# Altium schematic sheet Programmer.SchDoc
size A; SheetNumber: 3; SheetTotal: 5
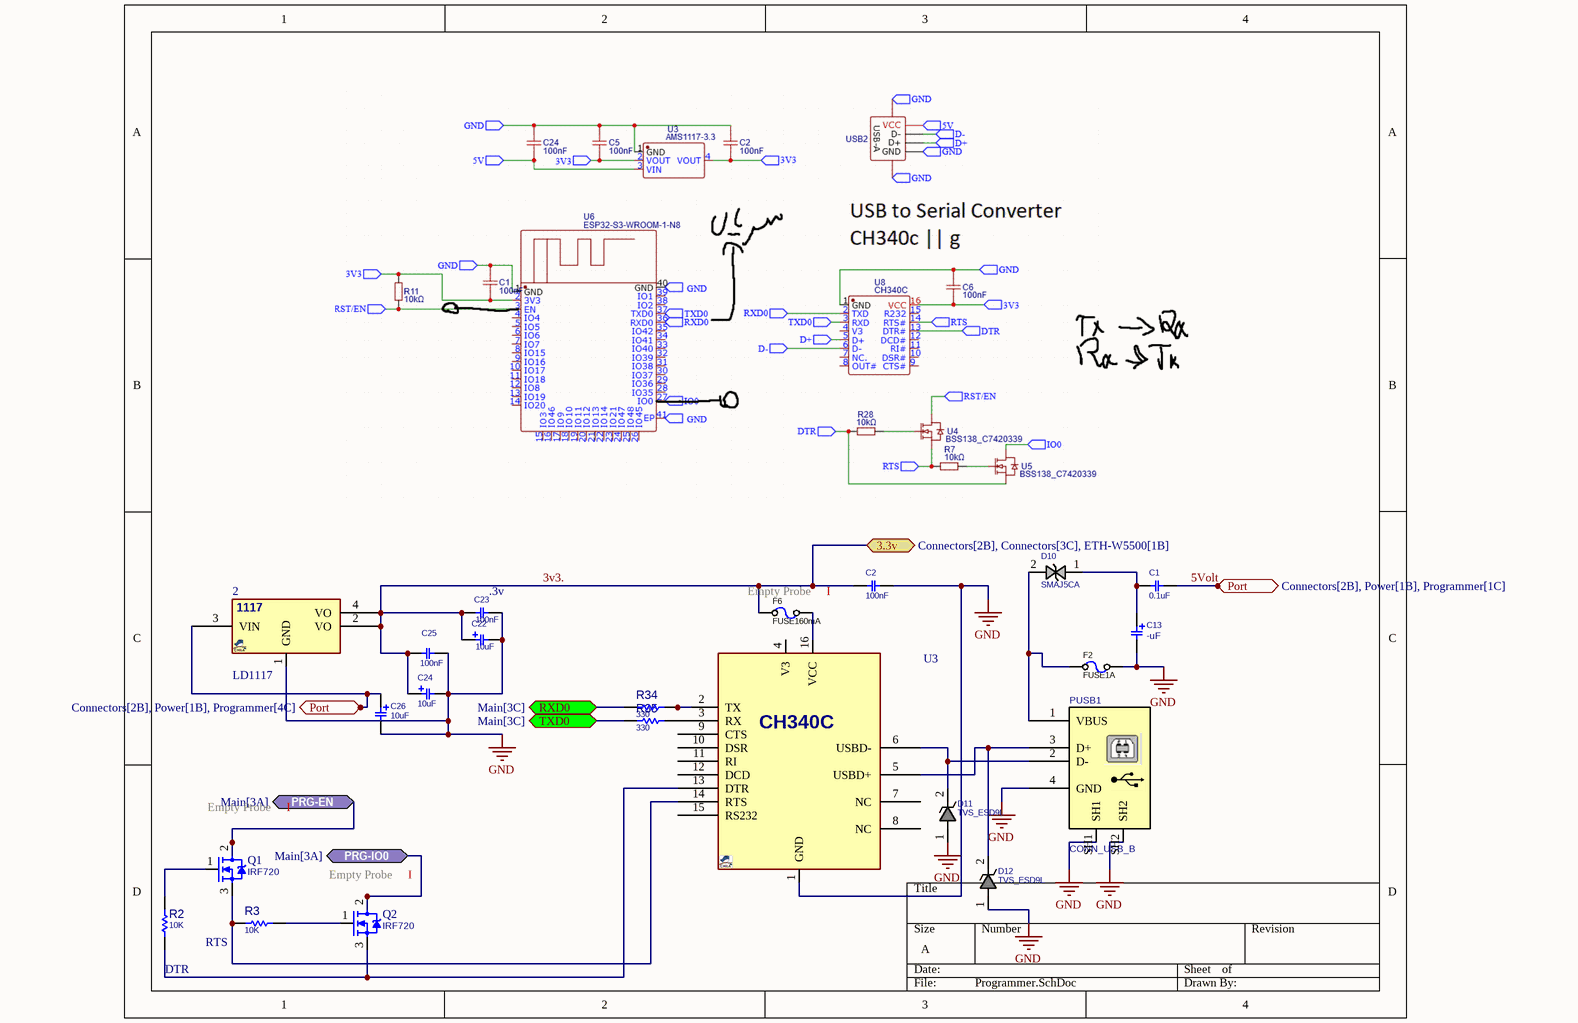
[diagram p0: Programmer.SchDoc]

## Parts
2  LD1117  [SOT223_4]
C1  0.1uF  [C_CERM_D4]
C2  100nF  [C_CERM_D3]
C13  -uF  [C_TN_3216]
C22  10uF  [C_EL_4X7]
C23  100nF  [C_CERM_D3]
C24  10uF  [C_EL_4X7]
C25  100nF  [C_CERM_D3]
C26  10uF  [C_EL_4X7]
D10  SMAJ5CA  [D_SMA]
D11  TVS_ESD9L  [D_SOD923]
D12  TVS_ESD9L  [D_SOD923]
F2  FUSE1A  [F2920]
F6  FUSE160mA  [F1206]
PUSB1  CONN_USB_B  [USB_B_RA_THD]
Q1  IRF720  [TO220_3]
Q2  IRF720  [TO220_3]
R2  10K  [R025W_AX04]
R3  10K  [R025W_AX04]
R34  330  [R025W_AX04]
R35  330  [R025W_AX04]
U3  CH340C  [SO_16]  (value not drawn)

## Ports
3.3v (bidir, see Connectors[2B], Connectors[3C], ETH-W5500[1B]), Port (bidir, see Connectors[2B], Power[1B], Programmer[1C]), Port (bidir, see Connectors[2B], Power[1B], Programmer[4C]), PRG-EN (bidir, see Main[3A]), PRG-IO0 (bidir, see Main[3A]), RXD0 (bidir, see Main[3C]), TXD0 (bidir, see Main[3C])

## Nets
GND: 2.1(GND) C2.1 C13.2 C22.2 C23.2 C24.2 C25.2 C26.2 D11.1 D12.1 F2.1 PUSB1.4(GND) PUSB1.SH1 PUSB1.SH2 U3.1(GND)
3v3.: 2.2(VO) 2.4(VO) C2.2 C22.1 C23.1 C24.1 C25.1 F6.1 ; port 3.3v
5Volt: 2.3(VIN) C1.2 C26.1 ; port Port
PRG-EN: Q1.2(D) ; port PRG-EN
PRG-IO0: Q2.2(D) ; port PRG-IO0
RXD0: R34.1 ; port RXD0
TXD0: R35.1 ; port TXD0
NetC1_1: C1.1 C13.1 D10.1
NetD10_2: D10.2 F2.2 PUSB1.1(VBUS)
NetD11_2: D11.2 PUSB1.2(D-) U3.6(USBD-)
NetD12_2: D12.2 PUSB1.3(D+) U3.5(USBD+)
NetF6_2: F6.2 U3.16(VCC)
NetQ1_1: Q1.1(G) R2.2
NetQ1_3: Q1.3(S) R3.1 U3.14(RTS)
NetQ2_1: Q2.1(G) R3.2
NetQ2_3: Q2.3(S) R2.1 U3.13(DTR)
NetR34_2: R34.2 U3.2(TX)
NetR35_2: R35.2 U3.3(RX)

Not connected (* = marked no-connect by the designer): U3 4(V3) 7(NC) 8(NC) 9(CTS) 10(DSR) 11(RI) 12(DCD) 15(RS232)

## Notes on the sheet
- (near C23) .3v
- (near R2) DTR
- RTS
- (in symbol VREG_1117_SOT223) 1117

## Library data of the parts
2 = VREG_1117_SOT223: REG, Linear, LDO1V, 0.8A, SOT-223; MANF_P#: LD1117, LM1117, AMS1117, TLV1117, REG1117, NCP1117, LT1117, SPX1117; MANF: TI, ON, ST; PARAM2: 1.2/1.5/1.8/2.5/2.85/3.3/5V; PARAM: LDO1V, 0.8A; VALUE: LD1117
C1 = CAP_THD_CER_0.1uF_50v: CAP, THD, CER MULTI LAYER,; DESC: CAP, CER MULTI LAYER,; MANF_P#: MANF_PART#; PARAM2: 50V; PRICE: 100= 1$; MANF: MANF; ASSEMBLY: ASSEMBLY; VALUE: 0.1uF
C2 C23 C25 = CAP_THD_CER: CAP, THD, CER MULTI LAYER,; DESC: CAP, CER MULTI LAYER,; MANF_P#: MANF_PART#; PARAM2: 50V; PRICE: 100= 1$; MANF: MANF; ASSEMBLY: ASSEMBLY; VALUE: 100nF
C13 = CAP_SMD_TAN_3216: CAP, SMD, TAN,; PARAM2: -V; VALUE: -uF
C22 C24 C26 = CAP_THD_EL_10u25V: CAP, THD, ELEC, 10uF, 25V; MANF_P#: MANF_PART#; PARAM: 25V; MANF: MANF; PARAM2: PARAM2; VALUE: 10uF
D10 = TVS_SMAJ5CA: TVS, ESD PROTECT, Bidirectional; MANF: Littelfuse; PARAM2: 5VR, 6.74VBR; PARAM: -65~150°C; MANF_P#: SMAJ5CA; PRICE: 0.5t@Paya; VALUE: SMAJ5CA
D11 D12 = TVS_ESD9L5: TVS, ESD PROTECT,; MANF_P#: ESD9L5.0ST5G; MANF: ON; PARAM: 5VRWM; VALUE: TVS_ESD9L
F2 = FUSE_PPTC1A_2920: Fuse, PPTC, 1A, 60v, 410mOhm, 2920; PARAM: 1A, 2A Itrip, 100A max, -40~85oC; MANF: Bel Fuse; MANF_P#: 0ZCF0100AF2A; PARAM2: 60VDC, 410mOhm; DESC: Resettable Fuse; PRICE: 0.4$; VALUE: FUSE1A
F6 = FUSE_160mA_1206: Fuse, 160mA, 63VDC, 1206, SMD, Fast Acting; PARAM: 160mA; 63VDC; slow-blow; MANF: Holly Fuse; MANF_P#: 12T-0160L; PARAM2: PARAM2; VALUE: FUSE160mA
PUSB1 = CONN_USB_B_RA_THD: CONN, USB, B, R/A, THD; MANF_P#: 292304-1; MANF: TE Connectivity; VALUE: CONN_USB_B
Q1 Q2 = MOSN_IRF720_TO220: MOSFET, N-CH, 1.8RDS, 3.3A, 400VDS, 2~4VGSth; MANF: VISHAY, ON; ASSEMBLY: ASSEMBLY; MANF_P#: IRF720; PARAM2: 400VDS, 2~4VGSth; PARAM: 1.8RDS, 3.3A; VALUE: IRF720
R2 R3 R34 R35 = RES_THD: RESISTOR, THD; MANF_P#: RK73H1ETTP4701F; MANF: KOA SPEER; PARAM: 0.063W; DESC: DESCRIPTION; DIST#: MOUSER; PARAM2: 1%; ASSEMBLY: ASSEMBLY; PRICE: 100= 0.5$
  R2 R3: VALUE: 10K
  R34 R35: VALUE: 330
U3 = CH340C_SOP16: USB-UART; MANF_P#: CH340C; VALUE: CH340C; PACKAGE: SOP-16